# Altium schematic sheet TP1 Embebidos.SchDoc
size A; SheetNumber: 1; SheetTotal: 1
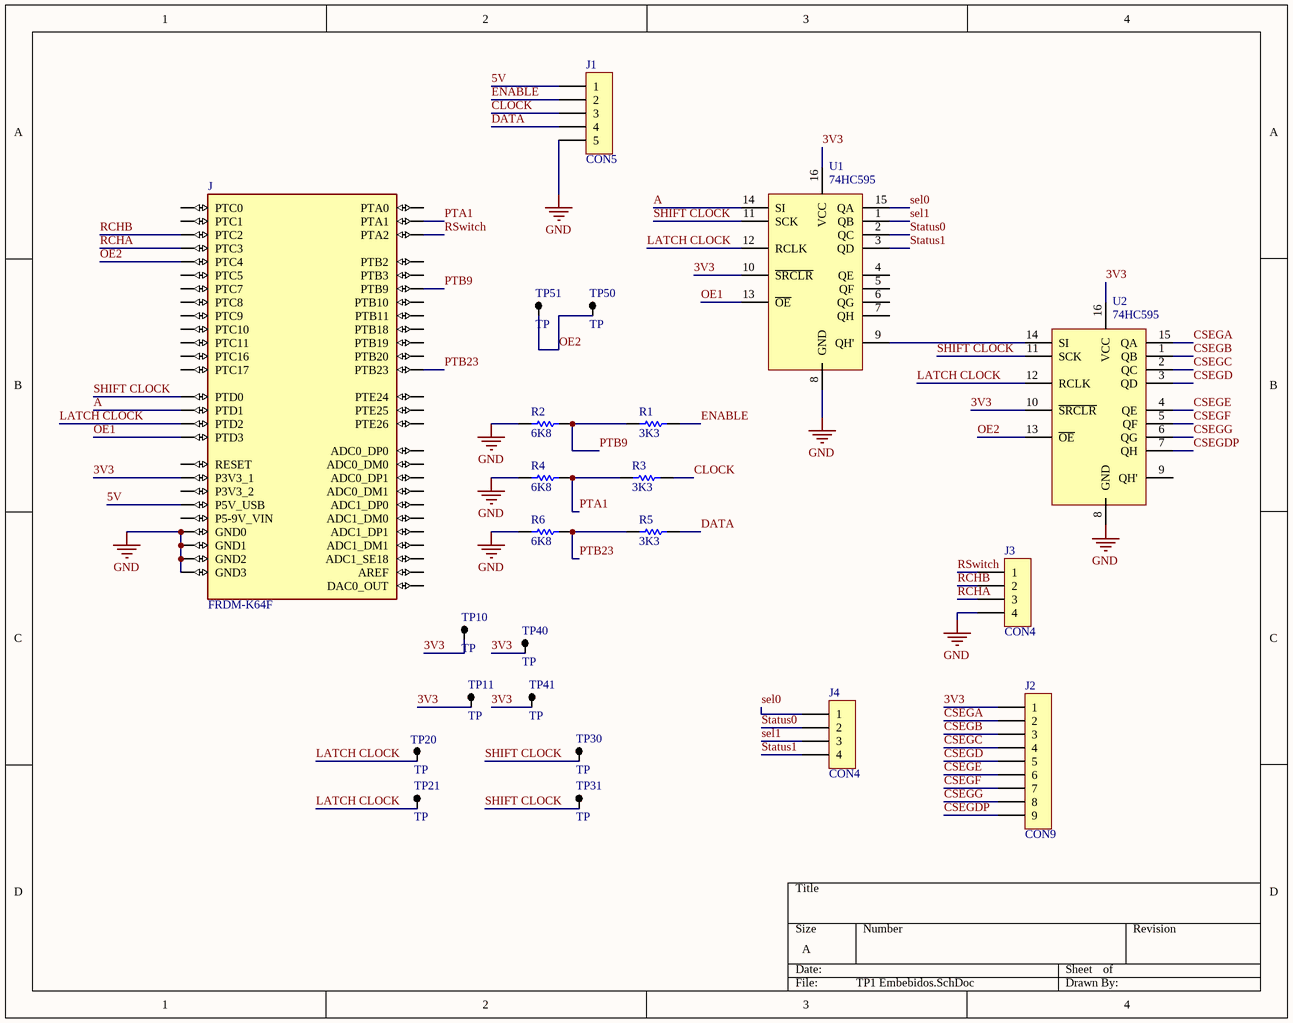
[diagram p0: TP1 Embebidos.SchDoc]

## Parts
J  FRDM-K64F  [FRDM-K64F]
J1  CON5  [SIP5]
J2  CON9  [SIP9]
J3  CON4  [SIP4]
J4  CON4  [SIP4]
R1  3K3  [RES400]
R2  6K8  [RES400]
R3  3K3  [RES400]
R4  6K8  [RES400]
R5  3K3  [RES400]
R6  6K8  [RES400]
TP10  TP  [TPTH]
TP11  TP  [TPTH]
TP20  TP  [TPTH]
TP21  TP  [TPTH]
TP30  TP  [TPTH]
TP31  TP  [TPTH]
TP40  TP  [TPTH]
TP41  TP  [TPTH]
TP50  TP  [TPTH]
TP51  TP  [TPTH]
U1  74HC595  [DIP16]
U2  74HC595  [DIP16]

## Nets
GND: J.J2-3(GND0) J.J2-14(GND1) J.J3-12(GND2) J.J3-14(GND3) J1.5 J3.4 R2.1 R4.1 R6.1 U1.8(GND) U2.8(GND)
3V3: J.J3-4(P3V3_1) J2.1 TP10.1 TP11.1 TP40.1 TP41.1 U1.10(~{SRCLR}) U1.16(VCC) U2.10(~{SRCLR}) U2.16(VCC)
5V: J.J3-10(P5V_USB) J1.1
A: J.J2-12(PTD1) U1.14(SI)
CLOCK: J1.3 R3.2
CSEGA: J2.2 U2.15(QA)
CSEGB: J2.3 U2.1(QB)
CSEGC: J2.4 U2.2(QC)
CSEGD: J2.5 U2.3(QD)
CSEGDP: J2.9 U2.7(QH)
CSEGE: J2.6 U2.4(QE)
CSEGF: J2.7 U2.5(QF)
CSEGG: J2.8 U2.6(QG)
DATA: J1.4 R5.2
ENABLE: J1.2 R1.2
LATCH CLOCK: J.J2-8(PTD2) TP20.1 TP21.1 U1.12(RCLK) U2.12(RCLK)
OE1: J.J2-10(PTD3) U1.13(~{OE})
OE2: J.J2-4(PTC4) TP50.1 TP51.1 U2.13(~{OE})
PTA1: J.J1-8(PTA1) R3.1 R4.2
PTB9: J.J1-6(PTB9) R1.1 R2.2
PTB23: J.J1-10(PTB23) R5.1 R6.2
RCHA: J.J1-16(PTC3) J3.3
RCHB: J.J1-14(PTC2) J3.2
RSwitch: J.J1-12(PTA2) J3.1
sel0: J4.1 U1.15(QA)
sel1: J4.3 U1.1(QB)
SHIFT CLOCK: J.J2-6(PTD0) TP30.1 TP31.1 U1.11(SCK) U2.11(SCK)
Status0: J4.2 U1.2(QC)
Status1: J4.4 U1.3(QD)
NetU1_9: U1.9(QH') U2.14(SI)

Not connected (* = marked no-connect by the designer): J J1-1(PTB18) J1-2(PTC16) J1-3(PTB19) J1-4(PTC17) J1-5(PTC1) J1-7(PTC8) J1-9(PTC9) J1-11(PTC0) J1-13(PTC7) J1-15(PTC5) J2-1(PTE26) J2-2(PTA0) J2-5(ADC0_DP0) J2-7(ADC0_DM0) J2-11(ADC1_DP0) J2-13(ADC1_DM0) J2-16(AREF) J2-17(ADC1_SE18) J2-18(PTE25) J2-20(PTE24) J3-6(RESET) J3-8(P3V3_2) J3-16(P5-9V_VIN) J4-1(ADC0_DP1) J4-2(PTB2) J4-3(ADC0_DM1) J4-4(PTB3) J4-5(ADC1_DP1) J4-6(PTB10) J4-7(ADC1_DM1) J4-8(PTB11) J4-9(PTB20) J4-10(PTC11) J4-11(DAC0_OUT) J4-12(PTC10); U1 4(QE) 5(QF) 6(QG) 7(QH); U2 9(QH')

## Library data of the parts
J = FRDM-K64F: K24, K63, K64, mbed-Enabled Development Freedom Kinetis ARMÂ® CortexÂ®-M4 MCU 32-Bit Embedded Evaluation Board; MF: NXP USA; Package: None; Value: *; Price: None; MP: FRDM-K64F; SnapEDA_Link: https://www.snapeda.com/parts/FRDM-K64F/NXP%20USA%20Inc./view-part/508270/?ref=snap; Availability: Unavailable
R1-R6 = RES